# Altium schematic sheet BioPrinter_Schematics.SchDoc
size A4; SheetNumber: 1; SheetTotal: 1
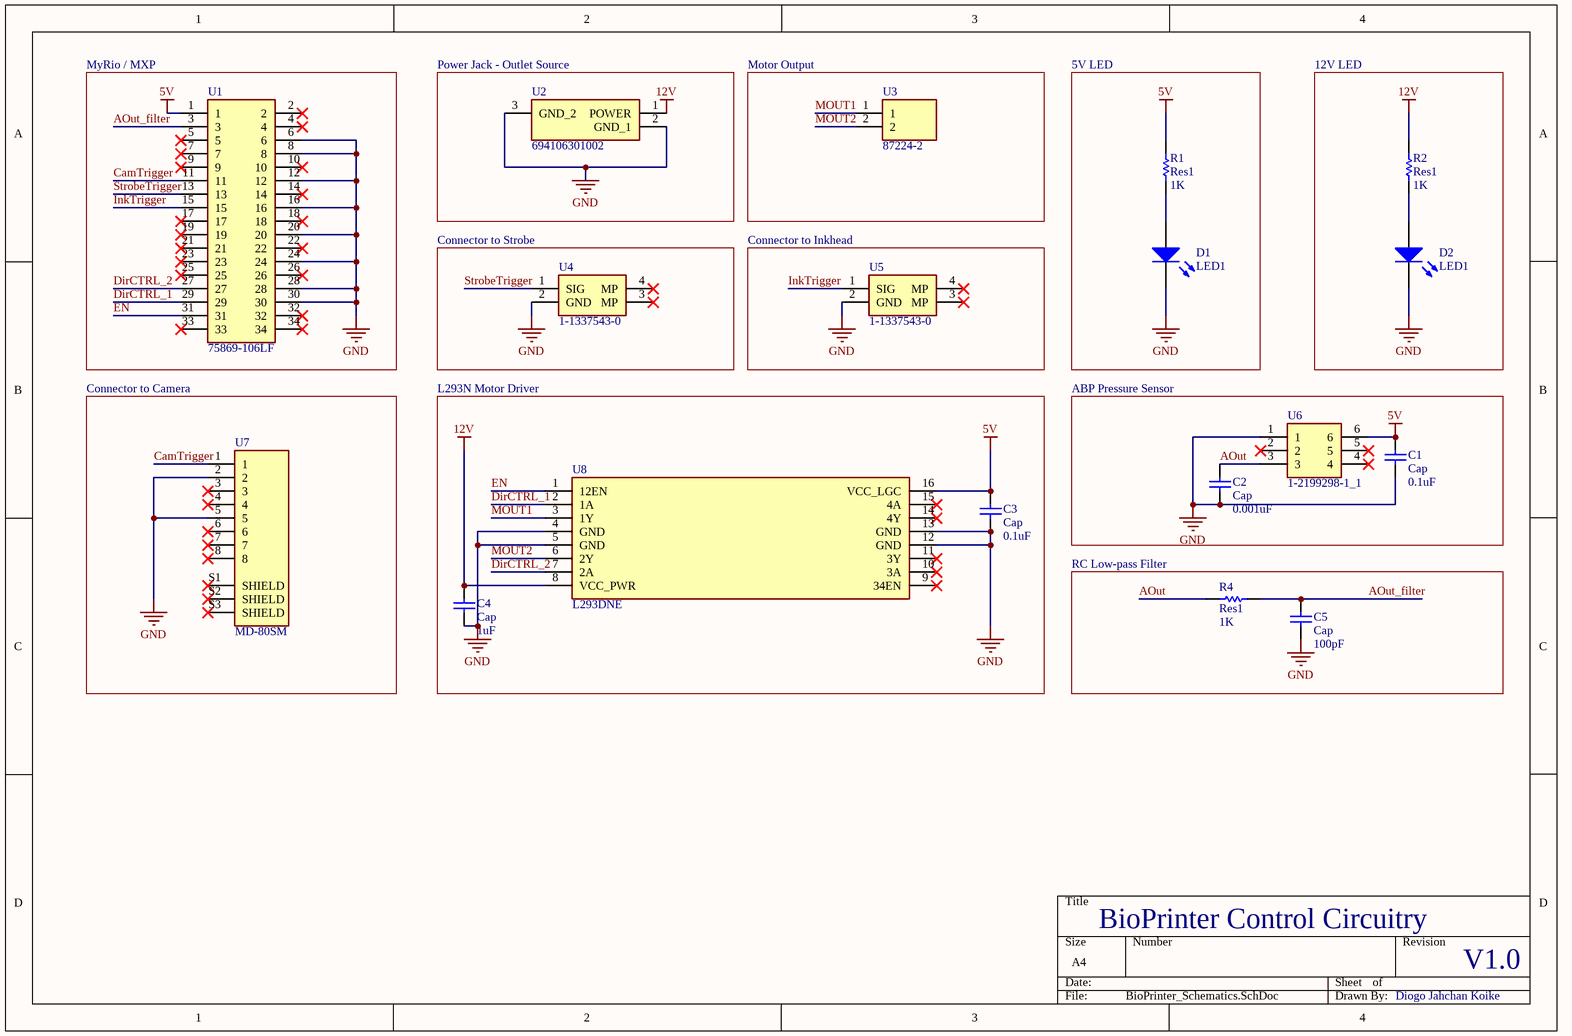
[diagram p0: BioPrinter_Schematics.SchDoc]

## Parts
C1  Cap  value 0.1uF  [RAD-0.3]
C2  Cap  value 0.001uF  [RAD-0.3]
C3  Cap  value 0.1uF  [RAD-0.3]
C4  Cap  value 1uF  [RAD-0.3]
C5  Cap  value 100pF  [RAD-0.3]
D1  LED1  [LED-1]
D2  LED1  [LED-1]
R1  Res1  value 1K  [AXIAL-0.3]
R2  Res1  value 1K  [AXIAL-0.3]
R4  Res1  value 1K  [AXIAL-0.3]
U1  75869-106LF  [SHDR34W62P254_2X17_5039X920X957P]
U2  694106301002  [694106301002_1]
U3  87224-2  [872242]
U4  1-1337543-0  [1-1337543-0]
U5  1-1337543-0  [1-1337543-0]
U6  1-2199298-1_1  [DIPS762W70P254L762H510Q6N - duplicate]
U7  MD-80SM  [CUI_MD-80SM]
U8  L293DNE  [DIP762W53P254L1980H508Q16N]

## Blocks framed on the sheet
MyRio / MXP: U1
Power Jack - Outlet Source: U2
Motor Output: U3
5V LED: D1 R1
12V LED: D2 R2
Connector to Strobe: U4
Connector to Inkhead: U5
Connector to Camera: U7
L293N Motor Driver: C3 C4 U8
ABP Pressure Sensor: C1 C2 U6
RC Low-pass Filter: C5 R4

## Nets
5V: C1.2 C3.2 R1.2 U1.1 U6.6 U8.16(VCC_LGC)
12V: C4.2 R2.2 U2.1(POWER) U8.8(VCC_PWR)
GND: C1.1 C2.1 C3.1 C4.1 C5.1 D1.2(K) D2.2(K) U1.6 U1.8 U1.12 U1.16 U1.20 U1.24 U1.28 U1.30 U2.2(GND_1) U2.3(GND_2) U4.2(GND) U5.2(GND) U6.1 U7.2 U7.5 U8.4(GND) U8.5(GND) U8.12(GND) U8.13(GND)
AOut: C2.2 R4.1 U6.3
AOut_filter: C5.2 R4.2 U1.3
CamTrigger: U1.11 U7.1
DirCTRL_1: U1.29 U8.2(1A)
DirCTRL_2: U1.27 U8.7(2A)
EN: U1.31 U8.1(12EN)
InkTrigger: U1.15 U5.1(SIG)
MOUT1: U3.1 U8.3(1Y)
MOUT2: U3.2 U8.6(2Y)
StrobeTrigger: U1.13 U4.1(SIG)
NetD1_1: D1.1(A) R1.1
NetD2_1: D2.1(A) R2.1

Not connected (* = marked no-connect by the designer): U1 2* 4* 5* 7* 9* 10* 14* 17* 18* 19* 21* 22* 23* 25* 26* 32* 33* 34*; U4 3(MP)* 4(MP)*; U5 3(MP)* 4(MP)*; U6 2* 4* 5*; U7 3* 4* 6* 7* 8* S1(SHIELD)* S2(SHIELD)* S3(SHIELD)*; U8 9(34EN)* 10(3A)* 11(3Y)* 14(4Y)* 15(4A)*

## Notes on the sheet
- BioPrinter Control Circuitry
- V1.0
- Diogo Jahchan Koike

## Library data of the parts
C1-C5 = Cap: Capacitor; Published: 8-Jun-2000; LatestRevisionDate: 17-Jul-2002; LatestRevisionNote: Re-released for DXP Platform.; PackageReference: RAD-0.3; Publisher: Altium Limited; PackageDescription: Radial Cap, Thru-Hole; 2 Leads; 0.3 in Pin Spacing
D1 D2 = LED1: Typical RED GaAs LED; Published: 8-Jun-2000; LatestRevisionDate: 08-Jul-2005; LatestRevisionNote: Mech Layer 1 removed.; PackageReference: LED-1; Publisher: Altium Limited; PackageDescription: LED; 2 Leads
R1 R2 R4 = Res1: Resistor; Published: 8-Jun-2000; LatestRevisionDate: 17-Jul-2002; LatestRevisionNote: Re-released for DXP Platform.; PackageReference: AXIAL-0.3; Publisher: Altium Limited; PackageDescription: Axial Device, Thru-Hole; 2 Leads; 0.3 in Pin Spacing
U1 = 75869-106LF: Connector; Manufacturer_Name: Amphenol Communication Solutions; Datasheet Link: https://cdn.amphenol-cs.com/media/wysiwyg/files/drawing/75869.pdf; Height: 9.57mm; Manufacturer_Part_Number: 75869-106LF; Mouser Part Number: 649-75869-106LF; Mouser Price/Stock: https://www.mouser.co.uk/ProductDetail/Amphenol-FCI/75869-106LF/?qs=1mQnGnLk3HrYHDyKPzWixQ%3D%3D; Arrow Part Number: 75869-106LF; Arrow Price/Stock: https://www.arrow.com/en/products/75869-106lf/amphenol-fci
U2 = 694106301002: WURTH ELEKTRONIK - 694106301002 - CONNECTOR, POWER ENTRY, JACK, 3A, 20VDC; Mouser Part Number: 710-694106301002; Mouser Price/Stock: https://www.mouser.co.uk/ProductDetail/Wurth-Elektronik/694106301002?qs=a9WhcLg8qCwOEkcI62k5mA%3D%3D; Manufacturer_Name: Wurth Elektronik; Manufacturer_Part_Number: 694106301002; Datasheet Link: https://datasheet.datasheetarchive.com/originals/distributors/Datasheets_SAMA/1c153bd2ba42bb51bda59ee4cd9765cd.pdf
U3 = 87224-2: Connector; Manufacturer_Name: TE Connectivity; Datasheet Link: https://datasheet.datasheetarchive.com/originals/distributors/Datasheets_SAMA/3b9b08c08f06dc562fe3ba32b60fa864.pdf; Height: 10.3632mm; Manufacturer_Part_Number: 87224-2; Mouser Part Number: 571-872242; Mouser Price/Stock: https://www.mouser.co.uk/ProductDetail/TE-Connectivity/87224-2?qs=ZDXmSm13591yVHBRfmL3UQ%3D%3D; Arrow Part Number: 87224-2; Arrow Price/Stock: https://www.arrow.com/en/products/87224-2/te-connectivity?region=europe
U4 U5 = 1-1337543-0: BNC Ins R/A PCB Skt 50Ohm White; Manufacturer_Name: TE Connectivity; Mouser Part Number: 571-1-1337543-0; Mouser Price/Stock: https://www.mouser.co.uk/ProductDetail/TE-Connectivity-AMP/1-1337543-0?qs=C39VGJgkyqP7s5Z2V1r6VA%3D%3D; Manufacturer_Part_Number: 1-1337543-0; Datasheet Link: http://www.te.com/commerce/DocumentDelivery/DDEController?Action=srchrtrv&DocNm=1337543&DocType=Customer+Drawing&DocLang=English
U6 = 1-2199298-1_1: Connector; Manufacturer_Name: TE Connectivity; Datasheet Link: https://www.te.com/commerce/DocumentDelivery/DDEController?Action=showdoc&DocId=Customer+Drawing%7F2199298%7FA%7Fpdf%7FEnglish%7FENG_CD_2199298_A_baseFilename.pdf%7F1-2199298-1; Height: 5.1mm; Manufacturer_Part_Number: 1-2199298-1; Mouser Part Number: 571-1-2199298-1; Mouser Price/Stock: https://www.mouser.co.uk/ProductDetail/TE-Connectivity/1-2199298-1?qs=fK8dlpkaUMsQ%252BTzExsKLsw%3D%3D; Arrow Part Number: 1-2199298-1; Arrow Price/Stock: https://www.arrow.com/en/products/1-2199298-1/te-connectivity?region=nac
U7 = MD-80SM: MF: {'manufacturer': u'CUI'}; Availability: Unavailable; Price: None; Package: None; Value: *; MP: MD-80SM
U8 = L293DNE: Integrated Circuit; Manufacturer_Name: Texas Instruments; Datasheet Link: http://www.ti.com/lit/ds/symlink/l293d.pdf; Height: 5.08mm; Manufacturer_Part_Number: L293DNE; Mouser Part Number: 595-L293DNE; Mouser Price/Stock: https://www.mouser.co.uk/ProductDetail/Texas-Instruments/L293DNE?qs=ZA235jQDfbp%2Fp7f5ThcsUA%3D%3D; Arrow Part Number: L293DNE; Arrow Price/Stock: https://www.arrow.com/en/products/l293dne/texas-instruments?region=nac